# Altium schematic sheet Schematic.SchDoc
size A4
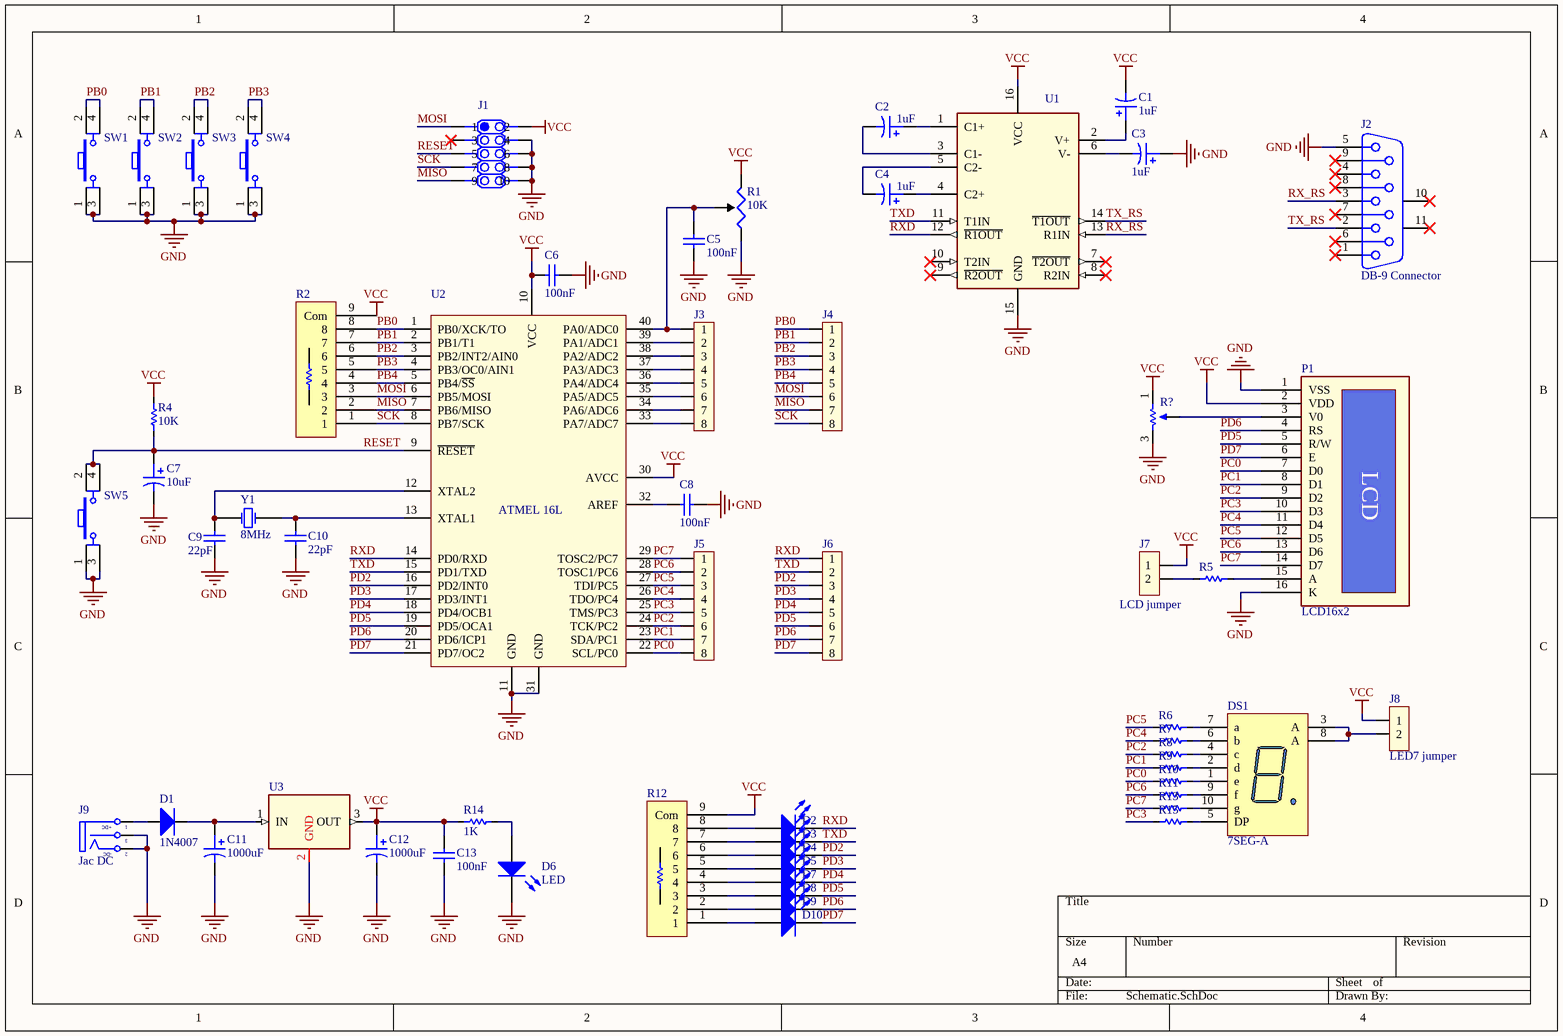
[diagram p0: Schematic.SchDoc]

## Parts
C1  value 1uF  [RADIAL B]  (hidden comment: Cap Pol)
C2  value 1uF  [RADIAL B]  (hidden comment: Cap Pol)
C3  value 1uF  [RADIAL B]  (hidden comment: Cap Pol)
C4  value 1uF  [RADIAL B]  (hidden comment: Cap Pol)
C5  value 100nF  [Cap Non-Pol 3mm]  (hidden comment: Cap Non-pol)
C6  value 100nF  [Cap Non-Pol 3mm]  (hidden comment: Cap Non-pol)
C7  value 10uF  [RADIAL C]  (hidden comment: Cap Pol)
C8  value 100nF  [Cap Non-Pol 3mm]  (hidden comment: Cap Non-pol)
C9  value 22pF  [Cap Non-Pol 3mm]  (hidden comment: Cap Non-pol)
C10  value 22pF  [Cap Non-Pol 3mm]  (hidden comment: Cap Non-pol)
C11  value 1000uF  [RADIAL F]  (hidden comment: Cap Pol)
C12  value 1000uF  [RADIAL F]  (hidden comment: Cap Pol)
C13  value 100nF  [Cap Non-Pol 3mm]  (hidden comment: Cap Non-pol)
D1  1N4007  [DO-41]
D2  LED  [LED-0 3mm RED]  (value not drawn)
D3  LED  [LED-0 3mm RED]  (value not drawn)
D4  LED  [LED-0 3mm RED]  (value not drawn)
D5  LED  [LED-0 3mm RED]  (value not drawn)
D6  LED  [LED-0 3mm RED]
D7  LED  [LED-0 3mm RED]  (value not drawn)
D8  LED  [LED-0 3mm RED]  (value not drawn)
D9  LED  [LED-0 3mm RED]  (value not drawn)
D10  LED  [LED-0 3mm RED]  (value not drawn)
DS1  7SEG-A  [7SEG_1LED]
J1  CON.HDR2x5  [HDR2X5]  (value not drawn)
J2  DB-9 Connector  [DB-9]
J3  JP8 PIN  [JP8]  (value not drawn)
J4  JP8 PIN  [JP8]  (value not drawn)
J5  JP8 PIN  [JP8]  (value not drawn)
J6  JP8 PIN  [JP8]  (value not drawn)
J7  LCD jumper  [CON.HDR1X2]
J8  LED7 jumper  [CON.HDR1X2]
J9  Jac DC  [DC-IN]
P1  LCD16x2  [LCD16x2]
R1  value 10K  [POT - 24mm]  (hidden comment: Trimmer)
R2  RES_PACK_8R  [Res Array]  (value not drawn)
R4  value 10K  [Res 10mm (1/2W)]  (hidden comment: RESISTOR)
R5  RESISTOR  [Res 10mm (1/2W)]  (value not drawn)
R6  RESISTOR  [Res 10mm (1/2W)]  (value not drawn)
R7  RESISTOR  [Res 10mm (1/2W)]  (value not drawn)
R8  RESISTOR  [Res 10mm (1/2W)]  (value not drawn)
R9  RESISTOR  [Res 10mm (1/2W)]  (value not drawn)
R10  RESISTOR  [Res 10mm (1/2W)]  (value not drawn)
R11  RESISTOR  [Res 10mm (1/2W)]  (value not drawn)
R12  RES_PACK_8R  [Res Array]  (value not drawn)
R13  RESISTOR  [Res 10mm (1/2W)]  (value not drawn)
R14  value 1K  [Res 10mm (1/2W)]  (hidden comment: RESISTOR)
R15  RESISTOR  [Res 10mm (1/2W)]  (value not drawn)
R?  RV20K  [RVAR10K]  (value not drawn)
SW1  SW  [SW4]  (value not drawn)
SW2  SW  [SW4]  (value not drawn)
SW3  SW  [SW4]  (value not drawn)
SW4  SW  [SW4]  (value not drawn)
SW5  SW  [SW4]  (value not drawn)
U1  MAX3232  [DIP16]  (value not drawn)
U2  ATMEL 16L  [DIP40/W0.6]
U3  LM78xx  [TO-220-3-Heatsink]  (value not drawn)
Y1  8MHz  [XTAL]

## Nets
GND: C3.1 C5.2 C6.1 C7.2 C8.2 C9.1 C10.1 C11.2 C12.2 C13.1 D6.2(K) J1.4 J1.6 J1.8 J1.10 J2.5 J9.2(TN) J9.3(S) P1.1(VSS) P1.16(K) R1.1 R?.3 SW1.1 SW1.3 SW2.1 SW2.3 SW3.1 SW3.3 SW4.1 SW4.3 SW5.1 SW5.3 U1.15(GND) U2.11(GND) U2.31(GND) U3.2(GND)
VCC: C1.2 C6.2 C12.1 C13.2 J1.2 J7.1 J8.1 P1.2(VDD) R1.3 R2.9(Com) R4.2 R12.9(Com) R14.1 R?.1 U1.16(VCC) U2.10(VCC) U2.30(AVCC) U3.3(OUT)
MISO: J1.9 J4.7 R2.2 U2.7(PB6/MISO)
MOSI: J1.1 J4.6 R2.3 U2.6(PB5/MOSI)
PB0: J4.1 R2.8 SW1.2 SW1.4 U2.1(PB0/XCK/TO)
PB1: J4.2 R2.7 SW2.2 SW2.4 U2.2(PB1/T1)
PB2: J4.3 R2.6 SW3.2 SW3.4 U2.3(PB2/INT2/AIN0)
PB3: J4.4 R2.5 SW4.2 SW4.4 U2.4(PB3/OC0/AIN1)
PB4: J4.5 R2.4 U2.5(PB4/~{SS})
PC0: J5.8 P1.7(D0) R10.1 U2.22(SCL/PC0)
PC1: J5.7 P1.8(D1) R9.1 U2.23(SDA/PC1)
PC2: J5.6 P1.9(D2) R8.1 U2.24(TCK/PC2)
PC3: J5.5 P1.10(D3) R15.1 U2.25(TMS/PC3)
PC4: J5.4 P1.11(D4) R7.1 U2.26(TDO/PC4)
PC5: J5.3 P1.12(D5) R6.1 U2.27(TDI/PC5)
PC6: J5.2 P1.13(D6) R11.1 U2.28(TOSC1/PC6)
PC7: J5.1 P1.14(D7) R13.1 U2.29(TOSC2/PC7)
PD2: D4.2(K) J6.3 U2.16(PD2/INT0)
PD3: D5.2(K) J6.4 U2.17(PD3/INT1)
PD4: D7.2(K) J6.5 U2.18(PD4/OCB1)
PD5: D8.2(K) J6.6 P1.5(R/W) U2.19(PD5/OCA1)
PD6: D9.2(K) J6.7 P1.4(RS) U2.20(PD6/ICP1)
PD7: D10.2(K) J6.8 P1.6(E) U2.21(PD7/OC2)
RESET: C7.1 J1.5 R4.1 SW5.2 SW5.4 U2.9(~{RESET})
RX_RS: J2.3 U1.13(R1IN)
RXD: D2.2(K) J6.1 U1.12(~{R1OUT}) U2.14(PD0/RXD)
SCK: J1.7 J4.8 R2.1 U2.8(PB7/SCK)
TX_RS: J2.2 U1.14(~{T1OUT})
TXD: D3.2(K) J6.2 U1.11(T1IN) U2.15(PD1/TXD)
NetC1_1: C1.1 U1.2(V+)
NetC2_1: C2.1 U1.1(C1+)
NetC2_2: C2.2 U1.3(C1-)
NetC3_2: C3.2 U1.6(V-)
NetC4_1: C4.1 U1.4(C2+)
NetC4_2: C4.2 U1.5(C2-)
NetC5_1: C5.1 J3.1 R1.2 U2.40(PA0/ADC0)
NetC8_1: C8.1 U2.32(AREF)
NetC9_2: C9.2 U2.12(XTAL2) Y1.2(OSC2)
NetC10_2: C10.2 U2.13(XTAL1) Y1.1(OSC1)
NetC11_1: C11.1 D1.2(K) U3.1(IN)
NetD1_1: D1.1(A) J9.1(T)
NetD2_1: D2.1(A) R12.8
NetD3_1: D3.1(A) R12.7
NetD4_1: D4.1(A) R12.6
NetD5_1: D5.1(A) R12.5
NetD6_1: D6.1(A) R14.2
NetD7_1: D7.1(A) R12.4
NetD8_1: D8.1(A) R12.3
NetD9_1: D9.1(A) R12.2
NetD10_1: D10.1(A) R12.1
NetDS1_1: DS1.1(e) R10.2
NetDS1_2: DS1.2(d) R9.2
NetDS1_3: DS1.3(A) DS1.8(A) J8.2
NetDS1_4: DS1.4(c) R8.2
NetDS1_5: DS1.5(DP) R15.2
NetDS1_6: DS1.6(b) R7.2
NetDS1_7: DS1.7(a) R6.2
NetDS1_9: DS1.9(f) R11.2
NetDS1_10: DS1.10(g) R13.2
NetJ3_2: J3.2 U2.39(PA1/ADC1)
NetJ3_3: J3.3 U2.38(PA2/ADC2)
NetJ3_4: J3.4 U2.37(PA3/ADC3)
NetJ3_5: J3.5 U2.36(PA4/ADC4)
NetJ3_6: J3.6 U2.35(PA5/ADC5)
NetJ3_7: J3.7 U2.34(PA6/ADC6)
NetJ3_8: J3.8 U2.33(PA7/ADC7)
NetJ7_2: J7.2 R5.1
NetP1_3: P1.3(V0) R?.2
NetP1_15: P1.15(A) R5.2

Not connected (* = marked no-connect by the designer): J1 3*; J2 1* 4* 6* 7* 8* 9* 10(MH1)* 11(MH2)*; U1 7(~{T2OUT})* 8(R2IN)* 9(~{R2OUT})* 10(T2IN)*

## Notes on the sheet
- (in symbol DCIN) +DC; -DC
- (in symbol LCD Text) LCD

## Library data of the parts
C1-C4 C7 C11 C12 = Cap Pol: Polarized Capacitor; LatestRevisionNote: Re-released for DXP Platform.; PackageReference: POLAR0.8; Publisher: Altium Limited
C5 C6 C8-C10 C13 = Cap Non-pol: Non-polarized Capacitor; LatestRevisionNote: Re-released for DXP Platform.; PackageReference: RAD-0.3; Publisher: Altium Limited
D1 = Diode 1N4007: 1 Amp General Purpose Rectifier; Published: 8-Jun-2000; LatestRevisionDate: 17-Jul-2002; LatestRevisionNote: Re-released for DXP Platform.; DatasheetVersion: 1998; PackageVersion: Aug-1999; PackageReference: DO-41; Publisher: Altium Limited; PackageDescription: Diode, Axial; Body 5.2 x 2.7 mm (LxDia. max), Lead Dia. 0.86 mm (max); Code_JEDEC: DO-204-AL; ComponentLink1Description: Manufacturer Link; ComponentLink1URL: http://www.fairchildsemi.com/; ComponentLink2Description: Datasheet; ComponentLink2URL: http://www.fairchildsemi.com/ds/1N%2F1N4001.pdf
D2-D10 = LED: Typical LED; Published: 8-Jun-2000; LatestRevisionDate: 08-Jul-2005; LatestRevisionNote: Mech Layer 1 removed.; PackageReference: LED-1; Publisher: Altium Limited
DS1 = LED7SEG-A: 14.2 mm General Purpose Blue 7-Segment Display: CA, RH DP, Gray Surface; MinimumIntensity: 2020 ucd; Note: IF = 10 mA; Published: 8-Jun-2000; LatestRevisionDate: 17-Dec-2003; LatestRevisionNote: Schematic revised, PCB Footprint replaced.; DatasheetDocument: 24-Sep-2002; PackageDocument: 24-Sep-2002; PackageReference: H; Publisher: Altium Limited; Colour: Blue; ComponentLink1Description: Manufacturer Link; ComponentLink1URL: http://www.agilent.com/
J1 = CON.HDR2x5: Header 2x5; Publisher: Hoang Nguyen; ComponentLink1Description: Digikey Part link; ComponentLink2Description: Open DataSheet; ComponentLink2URL: H:\LIBRARY\LIBRARY.Datasheet\
J2 = DB-9 Connector: 9-pin, D-Subminiature Connector; PackageDocument: O; Positions: 9; Gender: Receptacle; Published: 15-Jun-2001; LatestRevisionDate: 17-Jul-2002; LatestRevisionNote: Re-released for DXP Platform.; DatasheetDocument: 1-Sep-1999; PackageReference: 788750; Publisher: Altium Limited; Orientation: Right Angle
J3-J6 = JP8: Value: JP7
J7 J8 = JP2: Jumper 3; Value: J3
J9 = DCIN: Jac DC input; Value: Jac DC
P1 = LCD Text
R1 = Variable Resistor: Vendor: Digikey; Published: 8-Jun-2000; LatestRevisionDate: 04-Mar-2005; LatestRevisionNote: PCB Footprint replaced.; PackageReference: J1-0603; Publisher: Altium Limited; ComponentLink1Description: Digikey Part Link; ComponentLink2Description: Open Datasheet; ComponentLink2URL: H:\LIBRARY\LIBRARY.Datasheet\
R2 R12 = RES_PACK_8R: Isolated Resistor Network; Published: 24-Mar-1999; LatestRevisionDate: 17-Jul-2002; LatestRevisionNote: Re-released for DXP Platform.; PackageReference: SSOP16; Publisher: Altium Limited; Code_JEDEC: MO-150-AC
R5 = RESISTOR: Value: 0R; Published: 8-Jun-2000; LatestRevisionDate: 17-Jul-2002; LatestRevisionNote: Re-released for DXP Platform.; PackageReference: AXIAL-0.3; Publisher: Altium Limited
R6-R11 R13 R15 = RESISTOR: Value: 1K; Published: 8-Jun-2000; LatestRevisionDate: 17-Jul-2002; LatestRevisionNote: Re-released for DXP Platform.; PackageReference: AXIAL-0.3; Publisher: Altium Limited
R? = Variable Resistor_1: Variable Resistor; Sim Note: Enter the Resistance value and the set point into parameter fields.; Set Position: 0.5; Published: 8-Jun-2000; LatestRevisionDate: 17-Jul-2002; LatestRevisionNote: Re-released for DXP Platform.; PackageReference: VR5; Publisher: Altium Limited
SW1-SW5 = SW4: Switch button 4 pin; Value: Button chip 4 pin
U1 = MAX232: 3.0V TO 5.5V, Low-Power, up to 1Mbps, True RS-232 Transceiver Using Four 0.1µF External Capacitor; Manufacturer: Maxim Integrated Products; Manufacturer P/N: MAX3232CSE+; Vendor: Digikey; Vendor P/N: MAX3232CSE+-ND; Published: 13-April-2009; Publisher: Hoang Nguyen; ComponentLink1Description: Digikey Part Link; ComponentLink2Description: Open Datasheet; ComponentLink2URL: H:\LIBRARY\LIBRARY.Datasheet\; Price: 10000 VND
U2 = Atmega16L: 8-Bit AVR Microcontroller with 16K Bytes of In-System Programmable Flash Memory; Designed By: John MacTavish; Value: Atmega 16L
U3 = LM78xx: Regulator; Manufacturer: Fairchild Semiconductor Corporation; PSpiceTemplate: X^@REFDES %IN %OUT %GND @MODEL; Vendor: Digikey; Output Current: Up to 1A; V out: 5V; Tolerance: 4 %; Value: LM7805CT; Published: 13-April-2009; Publisher: Hoang Nguyen; ComponentLink1Description: Digikey Part Link; ComponentLink2Description: Open Datasheet; ComponentLink2URL: H:\LIBRARY\LIBRARY.Datasheet\LM7805.pdf; Price: 2500 VND
Y1 = XTAL: Crystal Oscillator; Published: 8-Jun-2000; LatestRevisionDate: 17-Jul-2002; LatestRevisionNote: Re-released for DXP Platform.; PackageReference: R38; Publisher: Altium Limited
R4 R14 = RESISTOR: Published: 8-Jun-2000; LatestRevisionDate: 17-Jul-2002; LatestRevisionNote: Re-released for DXP Platform.; PackageReference: AXIAL-0.3; Publisher: Altium Limited